# EAGLE design esp32_hr_module (EAGLE 9.5.1)
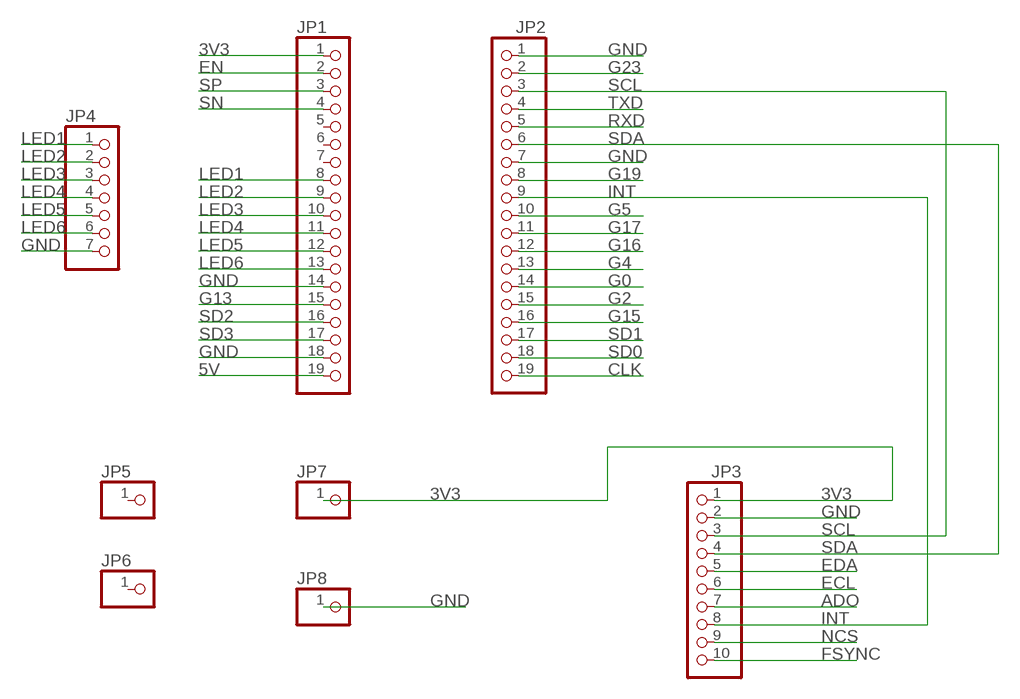
[diagram p0: schematic, sheet 1]

## Parts
JP1  PINHD-1X19  [1X19]
JP2  PINHD-1X19  [1X19]
JP3  PINHD-1X10  [1X10]
JP4  PINHD-1X7  [1X07]
JP5  PINHD-1X1  [1X01]
JP6  PINHD-1X1  [1X01]
JP7  PINHD-1X1  [1X01]
JP8  PINHD-1X1  [1X01]

## Nets
3V3: JP1.1 JP3.1 JP7.1
5V: JP1.19
ADO: JP3.7
CLK: JP2.19
ECL: JP3.6
EDA: JP3.5
EN: JP1.2
FSYNC: JP3.10
G0: JP2.14
G2: JP2.15
G4: JP2.13
G5: JP2.10
G13: JP1.15
G15: JP2.16
G16: JP2.12
G17: JP2.11
G19: JP2.8
G23: JP2.2
GND: JP1.14 JP1.18 JP2.1 JP2.7 JP3.2 JP4.7 JP8.1
INT: JP2.9 JP3.8
LED1: JP1.8 JP4.1
LED2: JP1.9 JP4.2
LED3: JP1.10 JP4.3
LED4: JP1.11 JP4.4
LED5: JP1.12 JP4.5
LED6: JP1.13 JP4.6
NCS: JP3.9
RXD: JP2.5
SCL: JP2.3 JP3.3
SD0: JP2.18
SD1: JP2.17
SD2: JP1.16
SD3: JP1.17
SDA: JP2.6 JP3.4
SN: JP1.4
SP: JP1.3
TXD: JP2.4
Unconnected: JP1.5 JP1.6 JP1.7 JP5.1 JP6.1

## Library data of the parts
JP1 JP2 = pinhead:PINHD-1X19: PIN HEADER
JP3 = pinhead:PINHD-1X10: PIN HEADER
JP4 = pinhead:PINHD-1X7: PIN HEADER
JP5-JP8 = pinhead:PINHD-1X1: PIN HEADER

## Board
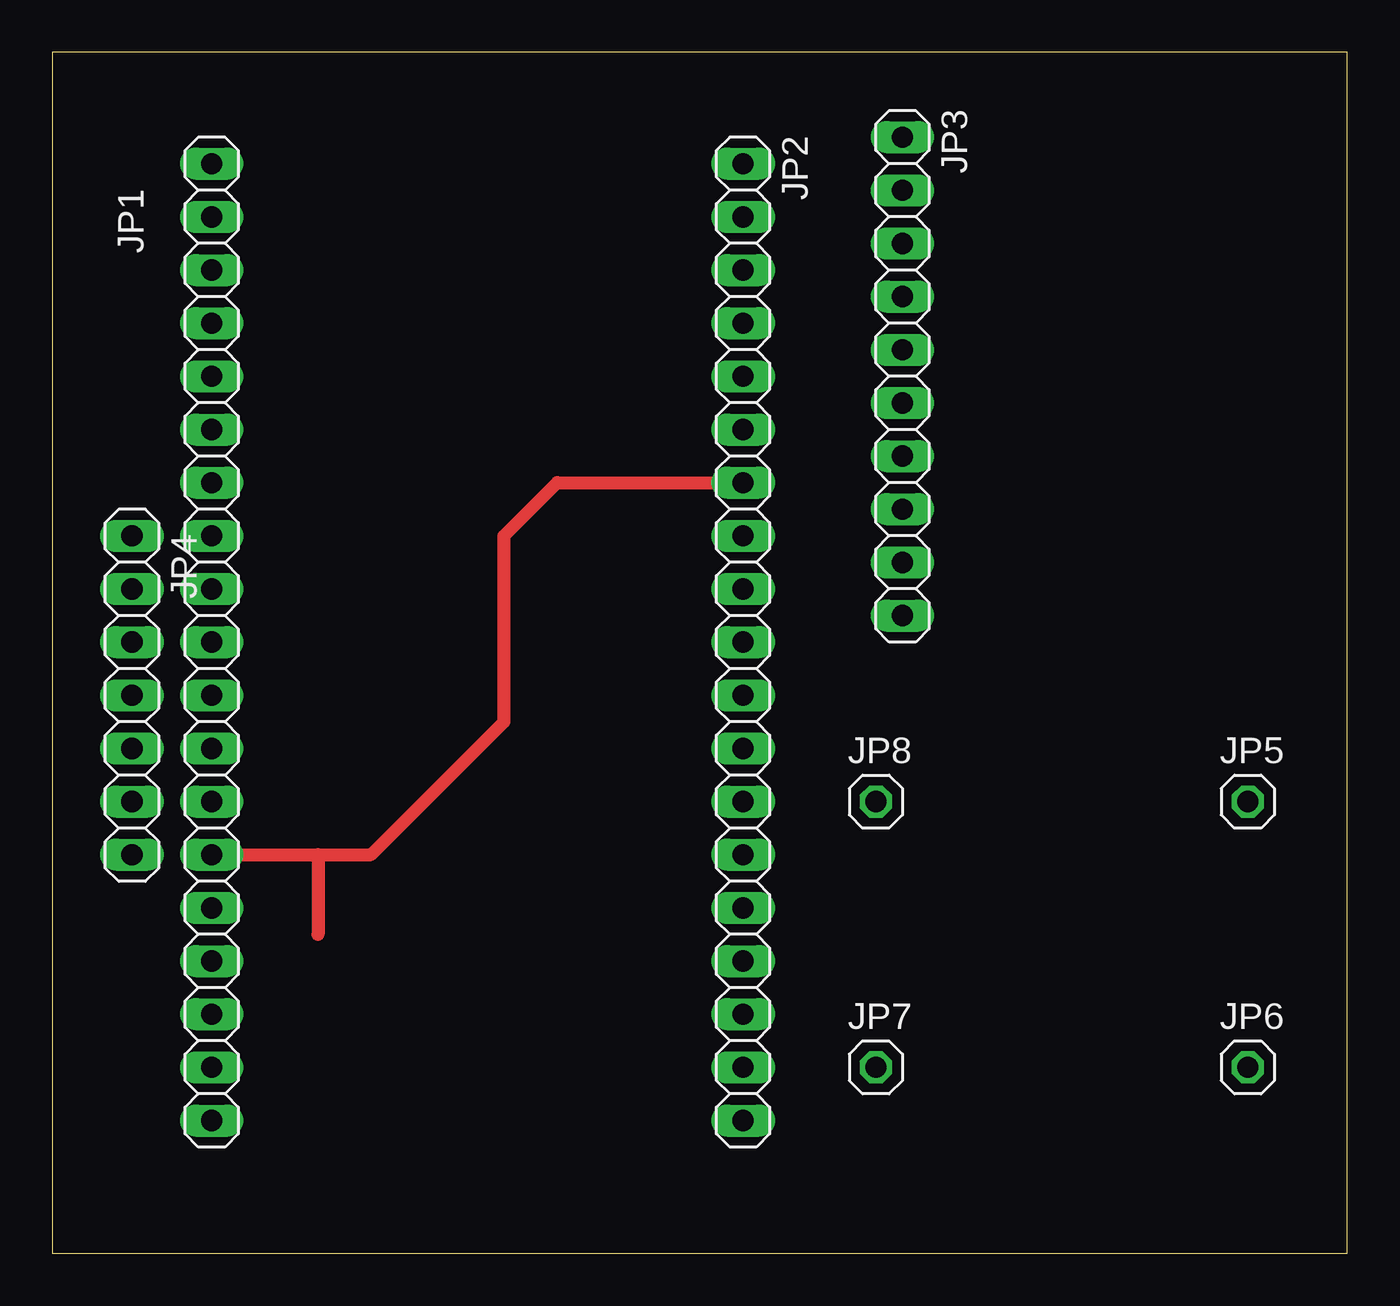
[diagram p1: board, top side]
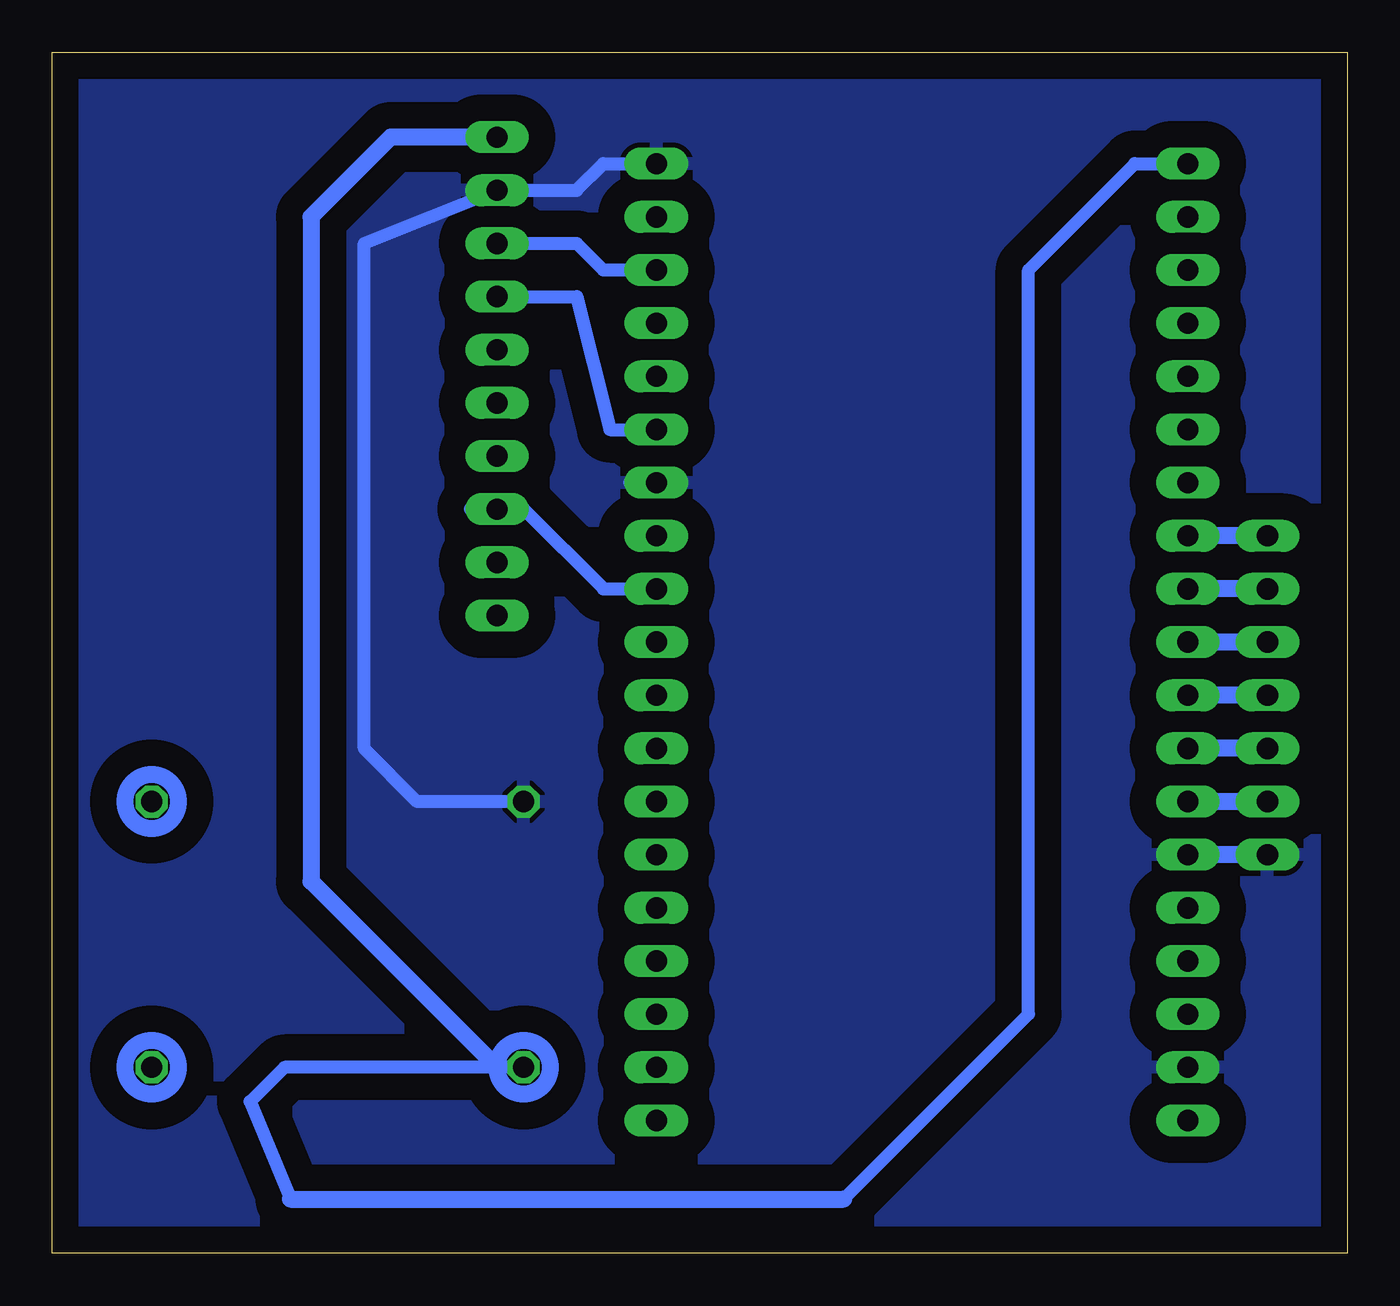
[diagram p2: board, bottom side, seen from below]

Size 61.9 x 57.39 mm. Coordinates in mm from the lower left corner, seen from the top.
Outline: 0,0 61.9,0 61.9,57.39 0,57.39 0,0
Copper layers (1*16): Top 0.035mm / dielectric 1.5mm / Bottom 0.035mm
Design rules "default": minimum track width 6mil, minimum drill 0.35mm, track to track 6mil, track to pad 6mil, pad to pad 6mil, via to via 6mil, smd to smd 6mil, copper to edge 40mil, drill to drill 6mil, minimum pad ring 10mil, minimum via ring 8mil, stop-mask expansion 4mil, vias tented up to drill 0mil, thermal gap 10mil

### Footprints (pad centres in the part's own frame; a part is rotated, then mirrored left to right if it is on the bottom)
1X19 = drill 1.016 long: 1 -22.86,0; 2 -20.32,0; 3 -17.78,0; 4 -15.24,0; 5 -12.7,0; 6 -10.16,0; 7 -7.62,0; 8 -5.08,0; 9 -2.54,0; 10 0,0; 11 2.54,0; 12 5.08,0; 13 7.62,0; 14 10.16,0; 15 12.7,0; 16 15.24,0; 17 17.78,0; 18 20.32,0; 19 22.86,0
1X10 = drill 1.016 long: 1 -11.43,0; 2 -8.89,0; 3 -6.35,0; 4 -3.81,0; 5 -1.27,0; 6 1.27,0; 7 3.81,0; 8 6.35,0; 9 8.89,0; 10 11.43,0
1X07 = drill 1.016 long: 1 -7.62,0; 2 -5.08,0; 3 -2.54,0; 4 0,0; 5 2.54,0; 6 5.08,0; 7 7.62,0
1X01 = drill 1.016 octagon: 1 0,0

### Placement (x,y rotation side)
JP1  7.62,29.21 270 top
JP2  33.02,29.21 270 top
JP3  40.64,41.91 270 top
JP4  3.81,26.67 270 top
JP5  57.15,21.59 0 top
JP6  57.15,8.89 0 top
JP7  39.37,8.89 0 top
JP8  39.37,21.59 0 top

### Tracks (layer width: path | path; a pad name or v marks a point on that pad's centre or on a via)
3V3
  Bottom 0.61: JP7.1 40.64,8.89 50.8,8.89 52.44,7.25 50.51,2.59 | JP1.1 10.16,52.07 15.24,46.99 15.24,11.43 24.08,2.59
  Bottom 0.813: 50.51,2.59 24.08,2.59 | JP3.1 45.72,53.34 49.53,49.53 49.53,17.78 40.64,8.89
GND
  Top 0.61: 12.7,15.24 12.7,19.05 JP1.14 15.24,19.05 21.59,25.4 21.59,34.29 24.13,36.83 JP2.7
  Bottom 0.61: JP2.1 35.56,52.07 36.83,50.8 JP3.2 46.99,48.26 46.99,24.13 44.45,21.59 JP8.1 | JP2.7 34.29,36.83
  Bottom 0.813: JP4.7 JP1.14
  pour Bottom (isolate 1.27): 0,0 0,57.15 62.23,57.15 62.23,0
INT
  Bottom 0.61: JP2.9 35.56,31.75 39.37,35.56 JP3.8 41.91,35.56
LED1
  Bottom 0.813: JP4.1 JP1.8
LED2
  Bottom 0.813: JP4.2 JP1.9
LED3
  Bottom 0.813: JP4.3 JP1.10
LED4
  Bottom 0.813: JP4.4 JP1.11
LED5
  Bottom 0.813: JP4.5 JP1.12
LED6
  Bottom 0.813: JP4.6 JP1.13
SCL
  Bottom 0.61: JP3.3 36.83,48.26 35.56,46.99 JP2.3
SDA
  Bottom 0.61: JP3.4 36.83,45.72 35.24,39.37 JP2.6
(copper drawn outside any net)
  shapes: Bottom circle x3